# EAGLE design breakout_STM32F030F4P6_2 (EAGLE 8.3.1)
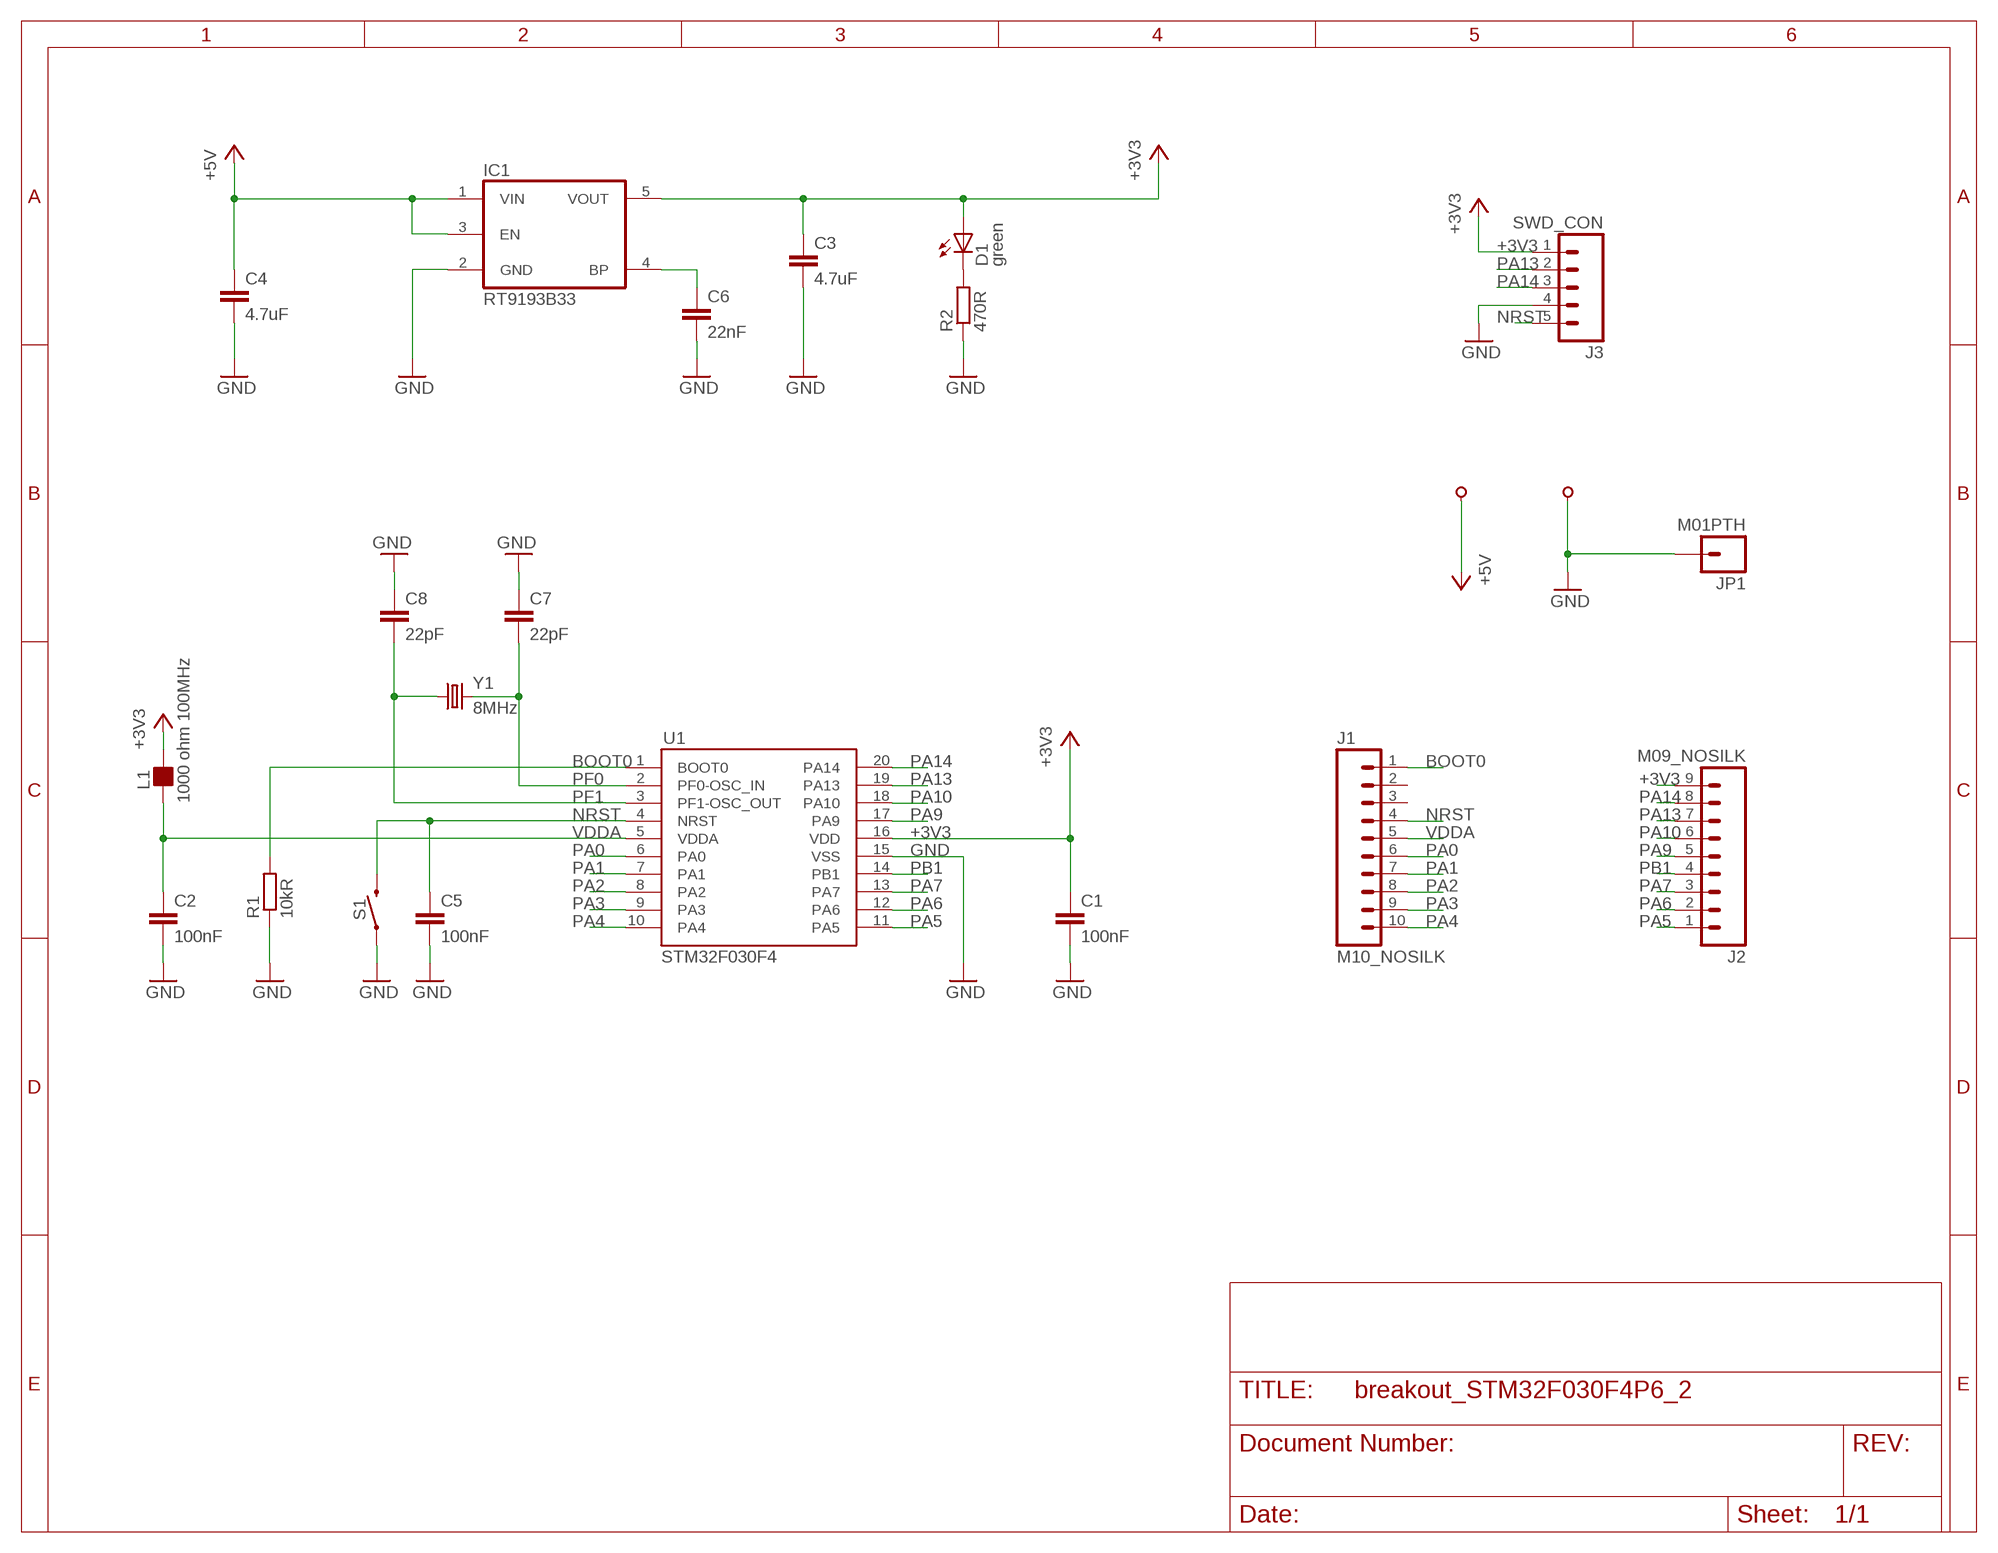
[diagram p0: schematic, sheet 1]

## Parts
5V  M01_1SQ  [M01_1SQ]
C1  100nF  C-EUC0805  [C0805]
C2  100nF  C-EUC0805  [C0805]
C3  4.7uF  C-EUC3216  [C3216]
C4  4.7uF  C-EUC3216  [C3216]
C5  100nF  C-EUC0805  [C0805]
C6  22nF  C-EUC0805  [C0805]
C7  22pF  C-EUC0805  [C0805]
C8  22pF  C-EUC0805  [C0805]
D1  green  LEDSML0805  [SML0805]
GND  M01_NOSILK  [M01_NOSILK]
IC1  RT9193B33  [TSOT23-5]
J1  M10_NOSILK  [M10_NOSILK]
J2  M09_NOSILK  [M09_NOSILK]
J3  SWD_CON  M05_NOSILK_1SQ  [M05_NOSILK_1SQ]
JP1  M01PTH  [1X01]
L1  1000 ohm 100MHz  FB_0805  [L0805]
R1  10kR  R-EU_R0805  [R0805]
R2  470R  R-EU_R0805  [R0805]
S1  MOMENTARY-SWITCH-SPST-SMD-5.2MM  [TACTILE_SWITCH_SMD_5.2MM]
U1  STM32F030F4  [TSSOP-20]
Y1  8MHz  CRYSTAL5X3  [CRYSTAL-SMD-5X3]

## Nets
+3V3: C1.1 C3.1 D1.A IC1.5(VOUT) J2.9 J3.1 L1.2 U1.16(VDD)
+5V: 5V.1 C4.1 IC1.1(VIN) IC1.3(EN)
BOOT0: J1.1 R1.2 U1.1(BOOT0)
GND: C1.2 C2.2 C3.2 C4.2 C5.2 C6.2 C7.1 C8.1 GND.1 IC1.2(GND) J3.4 JP1.1 R1.1 R2.1 S1.1 U1.15(VSS)
N$1: D1.C R2.2
N$3: C6.1 IC1.4(BP)
NRST: C5.1 J1.4 J3.5 S1.3 U1.4(NRST)
PA0: J1.6 U1.6(PA0)
PA1: J1.7 U1.7(PA1)
PA2: J1.8 U1.8(PA2)
PA3: J1.9 U1.9(PA3)
PA4: J1.10 U1.10(PA4)
PA5: J2.1 U1.11(PA5)
PA6: J2.2 U1.12(PA6)
PA7: J2.3 U1.13(PA7)
PA9: J2.5 U1.17(PA9)
PA10: J2.6 U1.18(PA10)
PA13: J2.7 J3.2 U1.19(PA13)
PA14: J2.8 J3.3 U1.20(PA14)
PB1: J2.4 U1.14(PB1)
PF0: C7.2 U1.2(PF0-OSC_IN) Y1.3
PF1: C8.2 U1.3(PF1-OSC_OUT) Y1.1
VDDA: C2.1 J1.5 L1.1 U1.5(VDDA)
Unconnected: J1.2 J1.3

## Library data of the parts
5V GND = flabbergast:M01
C1 C2 C5 = rcl:C-EU: CAPACITOR, European symbol
C3 C4 C6-C8 = resistor:C-EU: CAPACITOR, European symbol
D1 = led:LED: LED OSRAM: - CHIPLED LG R971, LG N971, LY N971, LG Q971, LY Q971, LO R971, LY R971 LH N974, LH R974 LS Q976, LO Q976, LY Q976 LO Q996 - Hyper CHIPLED LW Q18S LB Q993, LB Q99A, LB R99A - SideLED LS A670, LO A670, LY A670, LG A670, LP A670 LB A673, LV A673, LT A673, LW A673 LH A674 LY A675 LS A676, LA A676, LO A676, LY A676, LW A676 LS A679, LY A679, LG A679 - Hyper Micro SIDELED® LS Y876, LA Y876, LO Y876, LY Y876 LT Y87S - SmartLED LW L88C, LW L88S LB L89C, LB L89S, LG L890 LS L89K, LO L89K, LY L89K LS L896, LA L896, LO L896, LY L896 - TOPLED LS T670, LO T670, LY T670, LG T670, LP T670 LSG T670, LSP T670, LSY T670, LOP T670, LYG T670 LG T671, LOG T671, LSG T671 LB T673, LV T673, LT T673, LW T673 LH T674 LS T676, LA T676, LO T676, LY T676, LB T676, LH T676, LSB T676, LW T676 LB T67C, LV T67C, LT T67C, LS T67K, LO T67K, LY T67K, LW E67C LS E67B, LA E67B, LO E67B, LY E67B, LB E67C, LV E67C, LT E67C LW T67C LS T679, LY T679, LG T679 LS T770, LO T770, LY T770, LG T770, LP T770 LB T773, LV T773, LT T773, LW T773 LH T774 LS E675, LA E675, LY E675, LS T675 LS T776, LA T776, LO T776, LY T776, LB T776 LHGB T686 LT T68C, LB T68C - Hyper Mini TOPLED® LB M676 - Mini TOPLED Santana® LG M470 LS M47K, LO M47K, LY M47K Source: http://www.osram.convergy.de LUXEON: - LUMILED® LXK2-PW12-R00, LXK2-PW12-S00, LXK2-PW14-U00, LXK2-PW14-V00 LXK2-PM12-R00, LXK2-PM12-S00, LXK2-PM14-U00 LXK2-PE12-Q00, LXK2-PE12-R00, LXK2-PE12-S00, LXK2-PE14-T00, LXK2-PE14-U00 LXK2-PB12-K00, LXK2-PB12-L00, LXK2-PB12-M00, LXK2-PB14-N00, LXK2-PB14-P00, LXK2-PB14-Q00 LXK2-PR12-L00, LXK2-PR12-M00, LXK2-PR14-Q00, LXK2-PR14-R00 LXK2-PD12-Q00, LXK2-PD12-R00, LXK2-PD12-S00 LXK2-PH12-R00, LXK2-PH12-S00 LXK2-PL12-P00, LXK2-PL12-Q00, LXK2-PL12-R00 Source: www.luxeon.com KINGBRIGHT: KA-3528ASYC Source: www.kingbright.com
IC1 = richtek:RT9193*: 3.3V regulator
J1 = flabbergast:M10
J2 = flabbergast:M09
J3 = flabbergast:M05
JP1 = SparkFun:M01: Header 1 Standard 1-pin 0.1" header. Use with straight break away headers (SKU : PRT-00116), right angle break away headers (PRT-00553), swiss pins (PRT-00743), machine pins (PRT-00117), and female headers (PRT-00115).
L1 = rc-master:FB_: FERRITE BEAD
R1 R2 = rcl:R-EU_: RESISTOR, European symbol
S1 = SparkFun-Switches:MOMENTARY-SWITCH-SPST: Momentary Switch (Pushbutton) - SPST Normally-open (NO) SPST momentary switches (buttons, pushbuttons). Variants PTH-12MM - 12mm square, through-hole Momentary Pushbutton Switch - 12mm Square <https://www.sparkfun.com/products/9190> (COM-09190) PTH-6.0MM, PTH-6.0MM-KIT - 6.0mm square, through-hole Mini Pushbutton Switch <https://www.sparkfun.com/products/97> (COM-00097) KIT package intended for soldering kit's - only one side of pads' copper is exposed. PTH-RIGHT-ANGLE-KIT - Right-angle, through-hole Right Angle Tactile Button <https://www.sparkfun.com/products/10791> - Used on SparkFun BigTime Watch Kit <https://www.sparkfun.com/products/11734> SMD-12MM - 12mm square, surface-mount Tactile Button - SMD (12mm) <https://www.sparkfun.com/products/12993> (COM-12993) Used on SparkFun PicoBoard <https://www.sparkfun.com/products/11888> SMD-4.5MM - 4.5mm Square Trackball Switch Used on SparkFun Blackberry Trackballer Breakout <https://www.sparkfun.com/products/13169> SMD-4.6MMX2.8MM - 4.60mm x 2.80mm, surface mount Used on SparkFun SAMD21 Mini Breakout <https://www.sparkfun.com/products/13664> SMD-5.2MM, SMD-5.2-REDUNDANT - 5.2mm square, surface-mount Mini Pushbutton Switch - SMD <https://www.sparkfun.com/products/8720> (COM-08720) Used on Arduino Pro Mini <https://www.sparkfun.com/products/11114> REDUNDANT package connects both switch circuits together SMD-6.0X3.5MM - 6.0 x 3.5mm, surface mount Momentary Reset Switch SMD <https://www.sparkfun.com/products/8229> (COM-08229) SMD-6.2MM-TALL - 6.2mm square, surface mount Tactile Button - SMD (6mm) <https://www.sparkfun.com/products/12992> Used on SparkFun Digital Sandbox <https://www.sparkfun.com/products/12651> SMD-RIGHT-ANGLE - Right-angle, surface mount Used on SparkFun Block for Intel® Edison - Arduino <https://www.sparkfun.com/products/13036>; PROD_ID: SWCH-08247; SF_SKU: COM-08720
U1 = flabbergast:STM32F030F4
Y1 = SparkFun:CRYSTAL: Crystals Various standard crystals. Proven footprints. Spark Fun Electronics SKU : COM-00534

## Board
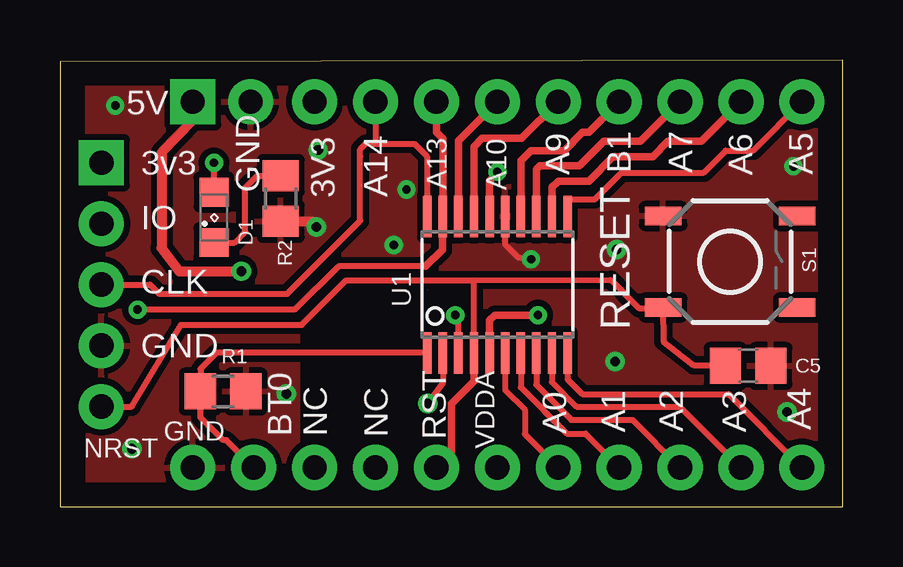
[diagram p1: board, top side]
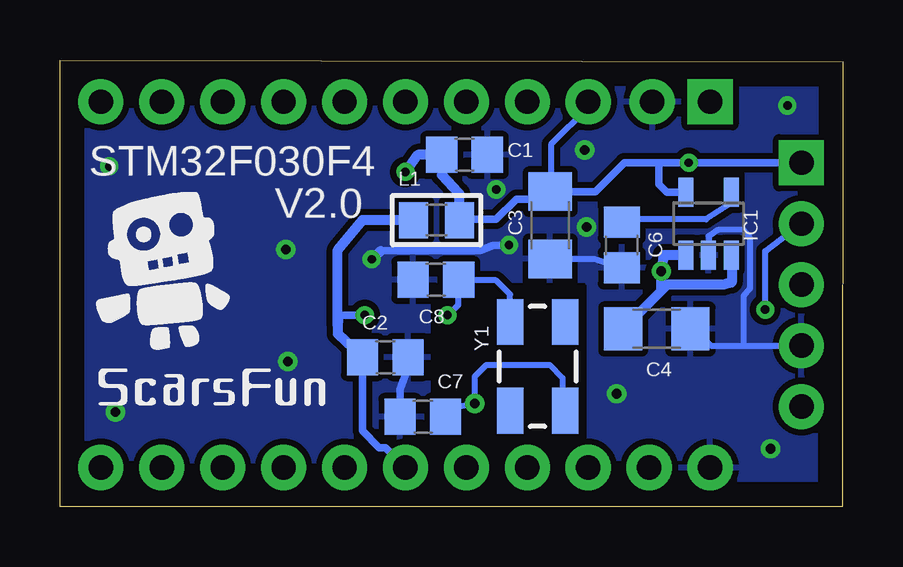
[diagram p2: board, bottom side, seen from below]

Size 32.64 x 18.62 mm. Coordinates in mm from the lower left corner, seen from the top.
Outline: 0,18.55 0.02,0.01 32.64,0 32.63,18.62 0,18.55
Copper layers (1*16): Top 0.035mm / dielectric 1.5mm / Bottom 0.035mm
Design rules "default *": minimum track width 10mil, minimum drill 24mil, track to track 10mil, track to pad 15mil, pad to pad 8mil, via to via 8mil, smd to smd 8mil, copper to edge 40mil, drill to drill 8mil, minimum pad ring 10mil, minimum via ring 8mil, stop-mask expansion 4mil, vias tented up to drill 25mil, thermal gap 10mil

### Footprints (pad centres in the part's own frame; a part is rotated, then mirrored left to right if it is on the bottom)
M01_1SQ = drill 1.016 pad 1.88 square: 1 0,0
C0805 = smd 1.3 x 1.5: 1 -0.95,0; 2 0.95,0
C3216 = smd 1.6 x 1.8: 1 -1.4,0; 2 1.4,0
SML0805 = smd 1.2 x 1.2: A 1.05,0; C -1.05,0
M01_NOSILK = drill 1.016 pad 1.88: 1 0,0
TSOT23-5 = smd 0.622 x 1.22: 1 -0.95,-1.31; 2 0,-1.31; 3 0.95,-1.31; 4 0.95,1.31; 5 -0.95,1.31
M10_NOSILK = drill 1.016 pad 1.88: 1 -10.16,0; 2 -7.62,0; 3 -5.08,0; 4 -2.54,0; 5 0,0; 6 2.54,0; 7 5.08,0; 8 7.62,0; 9 10.16,0; 10 12.7,0
M09_NOSILK = drill 1.016 pad 1.88: 1 -10.16,0; 2 -7.62,0; 3 -5.08,0; 4 -2.54,0; 5 0,0; 6 2.54,0; 7 5.08,0; 8 7.62,0; 9 10.16,0
M05_NOSILK_1SQ = drill 1.016 pad 1.88 square: 1 -5.08,0 | drill 1.016 pad 1.88: 2 -2.54,0; 3 0,0; 4 2.54,0; 5 5.08,0
1X01 = drill 1.016 pad 1.88: 1 0,0
L0805 = smd 1.2 x 1.5: 1 -0.953,0; 2 0.953,0
R0805 = smd 1.3 x 1.5: 1 -0.95,0; 2 0.95,0
TACTILE_SWITCH_SMD_5.2MM = smd 1.524 x 0.762: 1 -2.794,1.905; 2 2.794,1.905; 3 -2.794,-1.905; 4 2.794,-1.905
TSSOP-20 = smd 0.35 x 1.727: 1 -2.925,-2.845; 2 -2.275,-2.845; 3 -1.625,-2.845; 4 -0.975,-2.845; 5 -0.325,-2.845; 6 0.325,-2.845; 7 0.975,-2.845; 8 1.625,-2.845; 9 2.275,-2.845; 10 2.925,-2.845; 11 2.925,2.845; 12 2.275,2.845; 13 1.625,2.845; 14 0.975,2.845; 15 0.325,2.845; 16 -0.325,2.845; 17 -0.975,2.845; 18 -1.625,2.845; 19 -2.275,2.845; 20 -2.925,2.845
CRYSTAL-SMD-5X3 = smd 1.9 x 1.1: 1 -1.85,-1.15; 2 1.85,-1.15; 3 1.85,1.15; 4 -1.85,1.15

### Placement (x,y rotation side)
5V  5.53,16.87 0 top
C1  15.77,14.66 0 bottom
C2  19.07,6.23 0 bottom
C3  12.2,11.73 270 bottom
C4  7.76,7.41 0 bottom
C5  28.69,5.88 0 top
C6  9.22,10.91 270 bottom
C7  17.51,3.75 0 bottom
C8  16.96,9.46 0 bottom
D1  6.42,12.06 90 top
GND  5.53,1.63 0 top
IC1  5.6,11.79 0 bottom
J1  18.23,1.63 0 top
J2  20.77,16.87 180 top
J3  1.72,9.25 270 top
JP1  7.95,16.87 0 top
L1  16.94,11.95 0 bottom
R1  6.8,4.81 180 top
R2  9.2,12.85 90 top
S1  27.94,10.21 0 top
U1  18.23,9.25 0 top
Y1  12.72,5.85 270 bottom

### Tracks (layer width: path | path; a pad name or v marks a point on that pad's centre or on a via)
+3V3  (via drill 0.35, 0.35 pad 0.7)
  Top 0.254: D1.A v6.42,14.33
  Top 0.305: U1.16 17.92,13.57 v18.23,13.95
  Bottom 0.254: 16.71,14.27 C1.1 | 15.96,11.97 L1.2 | 7.67,14.26 7.59,14.33 | 12.27,13.06 12.51,12.82 | 12.27,13.06 C3.1 | J2.9 10.61,16.65 12.16,15.1 12.16,13.17 12.27,13.06
  Bottom 0.305: 15.96,11.97 14.45,11.97 13.6,12.82 12.51,12.82 | C3.1 11.12,13.13 10.32,13.13 9.11,14.33 7.59,14.33 v6.42,14.33 J3.1 | 7.67,14.26 7.67,13.45 7.33,13.1 IC1.5
  Bottom 0.406: 16.71,14.27 16.71,13.83 16.02,13.09 15.99,13.05 L1.2 | C1.1 17.73,14.66 v18.23,13.95
+5V  (via drill 0.4 pad 0.75)
  Top 0.406: 5V.1 5.53,16.11 4.24,14.77 4.24,10.78 4.97,9.81 v7.57,9.81
  Bottom 0.406: 7.57,9 v7.57,9.81 7.48,10.48 IC1.1 | 7.57,9 C4.1 | IC1.3 4.63,9.35 4.96,9.25 7.31,9.25 7.57,9
BOOT0
  Top 0.254: J1.1 6.93,2.78 6.8,2.78 5.85,3.73 R1.2 5.86,5.75 6.52,6.41 U1.1
GND  (via drill 0.35, 0.4)
  Top 0.254: U1.15 18.56,10.94 19.1,10.4 v19.64,10.31
  Top 0.406: R2.1 10.5,11.9 v10.69,11.65
  Bottom 0.254: 6.15,7.36 5.5,6.71 4.14,6.71 | 4.14,6.71 J3.4 | C3.2 10.35,10.33 C6.2 | 4.14,6.71 4.14,8.78 3.88,9.1 3.88,11.22 4.14,11.54 5.21,11.54 5.59,11.28 5.59,10.5 IC1.2
  Bottom 0.305: C6.2 9.36,9.87 | C4.2 6.15,7.36 | C2.2 18.21,6.15 18.21,5.57 18.45,4.9 C7.1 | v13.92,10.91 14.57,10.91 15.15,10.66 19.26,10.66
  Bottom 0.406: 19.26,10.66 v19.64,10.31
  other vias: 30.58,14.18 10.76,14.86 2.31,16.72 23.14,6.05 30.32,3.96 9.43,4.71 14.45,13.22 23.21,10.72 3.01,2.42
  pour Top: 0.61,18.1 32.07,18.01 32.07,0.56 0.61,0.64
  pour Bottom: 0.93,17.87 32.08,17.79 32.07,17.72 32.09,1.05 0.95,1.07
N$1
  Top 0.254: D1.C 7.27,11.01 7.72,11.46 7.72,13.29 8.22,13.78 9.19,13.78 R2.2
N$2
  pour Top: 10.39,9.31 15.33,9.31 15.34,9.3 15.34,1.8 15.27,1.72 10.29,1.72 10.14,1.88 10.14,9 10.44,9.3
N$3
  Bottom 0.254: IC1.4 4.66,12.64 5.71,11.97 9.51,11.98 C6.1
N$4
  cutout Top: 10.26,9.1 15.22,9.1 15.42,8.9 15.42,1.6 15.37,1.54 10.05,1.54 10.02,1.52 10.02,8.82 10.29,9.09
N$5
  cutout Bottom: 10.76,9.32 17.15,9.32 17.16,9.3 17.16,2.98 17.07,2.88 10.84,2.88 10.69,3.03 10.69,9.24 10.77,9.32
NRST
  Top 0.254: J3.5 2.99,4.17 5.05,7.58 10.08,7.58 11.93,9.43 17.2,9.43 | 17.26,6.45 17.26,9.42 17.2,9.43 | 17.2,9.43 22.96,9.45 24.13,8.28 25.6,8.26 S1.3 25.16,6.88 26.41,5.9 27.71,5.9 C5.1
  Top 0.305: J1.4 16.33,2.27 16.33,4.3 17.26,5.23 U1.4 17.26,6.45
PA0
  Top 0.254: U1.6 18.56,4.87 19.38,4.05 19.38,3.03 J1.6
PA1
  Top 0.254: U1.7 19.21,4.98 21.14,3.05 21.91,3.05 J1.7
PA2
  Top 0.254: U1.8 19.86,5.09 21.32,3.63 23.87,3.63 J1.8
PA3
  Top 0.254: U1.9 20.51,5.2 21.53,4.17 25.85,4.17 J1.9
PA4
  Top 0.254: U1.10 21.16,5.31 21.78,4.69 27.88,4.69 J1.10
PA5
  Top 0.254: 21.15,12.81 22.3,12.81 23.41,13.92 26.84,13.92 27.76,14.84 28.9,14.84 J2.1
  Top 0.305: U1.11 21.16,12.81 21.15,12.81
PA6
  Top 0.305: U1.12 20.51,13.31 20.77,13.57 22.04,13.57 23.06,14.59 24.71,14.59 25.35,15.22 26.74,15.22 J2.2
PA7
  Top 0.305: U1.13 19.86,14.05 20.01,14.21 21.66,14.21 22.68,15.22 24.2,15.22 J2.3
PA9
  Top 0.305: U1.17 17.26,15.01 17.6,15.35 19.25,15.35 J2.5
PA10
  Top 0.305: U1.18 16.61,15.25 J2.6
PA13  (via drill 0.35)
  Top 0.254: 15.25,10.02 11.6,10.02 9.78,8.21 v3.23,8.21
  Top 0.305: J2.7 15.69,15.6 15.96,15.34 U1.19 15.95,12.09 15.95,10.71 15.25,10.02
  Bottom 0.254: v3.23,8.21 3.23,10.65 J3.2
PA14
  Top 0.254: U1.20 15.3,14.6 14.78,15.12 13.11,15.12 | J3.3 3.76,9.25 4.14,8.87 9.47,8.87 12.52,11.92 12.51,14.6 12.51,14.89 12.74,15.12 13.11,15.12 | J2.8 13.15,15.16 13.11,15.12
PB1
  Top 0.305: U1.14 19.21,14.42 19.63,14.84 21.03,14.84 21.79,15.6 22.04,15.6 J2.4
PF0  (via drill 0.4)
  Top 0.254: U1.2 15.96,5.18 v15.34,4.31
  Bottom 0.254: Y1.3 11.68,4.34 11.68,5.37 12.21,5.91 14.86,5.91 15.34,5.43 v15.34,4.31 16.07,4.17 C7.2
PF1  (via drill 0.35)
  Top 0.254: U1.3 16.61,7.86 v16.48,7.98
  Bottom 0.254: v16.48,7.98 16.46,7.98 16.02,8.42 C8.2 15.99,9.43 14.45,9.43 13.87,8.86 Y1.1
VDDA  (via drill 0.35)
  Top 0.305: U1.5 17.91,7.77 18.13,7.99 v19.93,7.99
  Bottom 0.305: v19.93,7.99 20.96,7.99 21.01,7.58 21.05,7.54 | J1.5 19.07,2.47 19.33,2.47 20.02,3.16 C2.1
  Bottom 0.406: L1.1 20.04,11.95 21.05,10.7 21.05,7.54 21.05,7.21 20.09,6.3 C2.1 20.02,6.22

### Text on the board
_tsilk: 5V | 3v3 | A9 | B1 | A7 | A6 | A5 | GND | 3V3 | A14 | A13 | A10 | IO | CLK | RESET | GND | RST | VDDA | NRST | GND | BT0 | NC | NC | A0 | A1 | A2 | A3 | A4
_bsilk: STM32F030F4 | V2.0